# EAGLE design back (EAGLE 9.0.1)
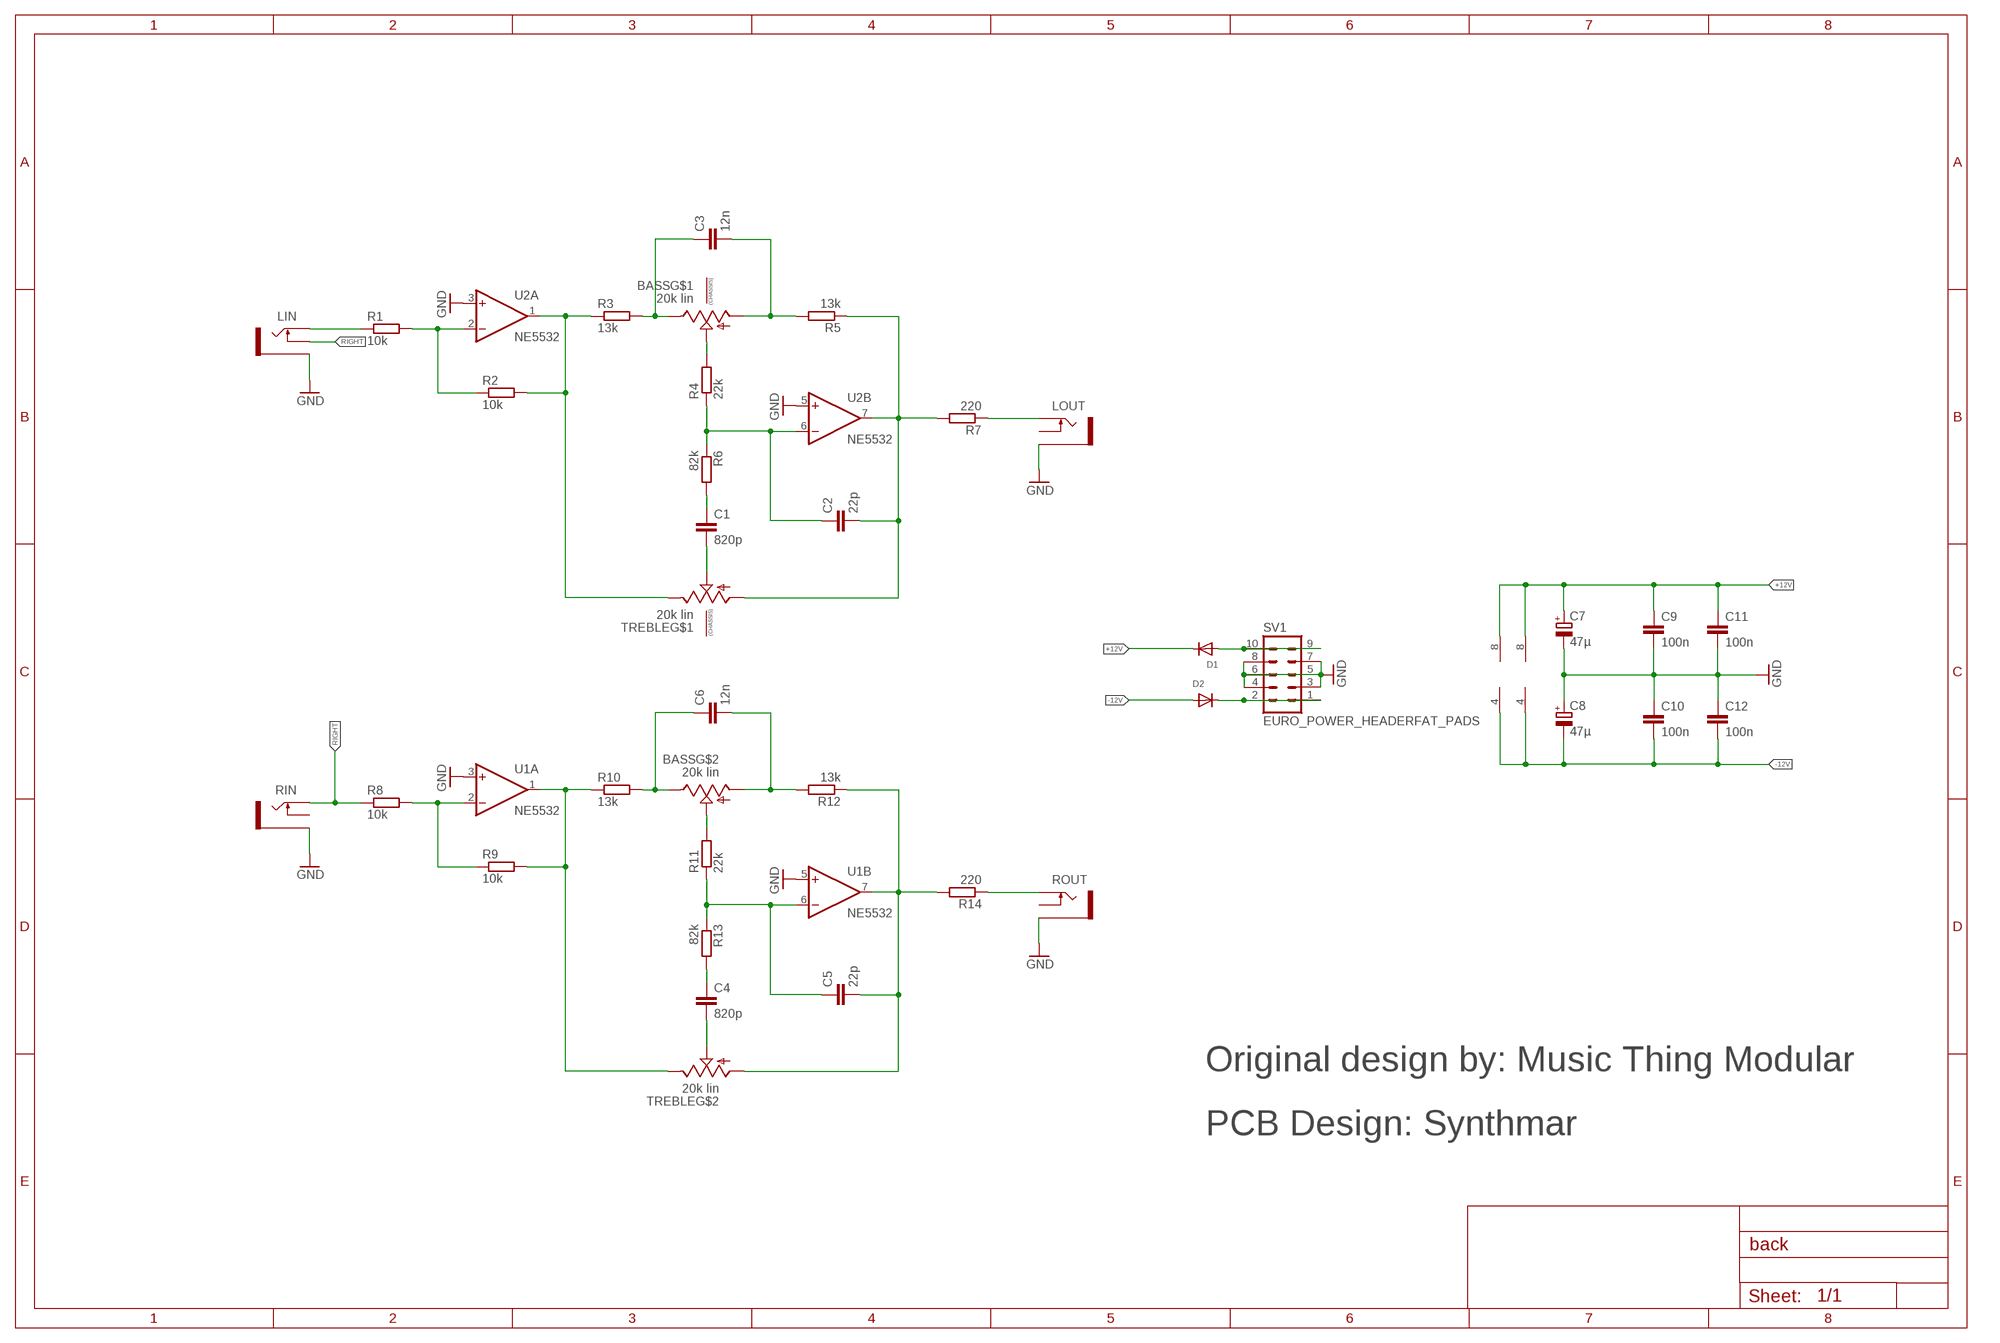
[diagram p0: schematic, sheet 1]

## Parts
BASS  20k lin  ALPHA-9MM-DUALPOT  [DUAL_9MM_SNAP-IN_POT]
C1  820p  C-EUC1206  [C1206]
C2  22p  C-EUC1206  [C1206]
C3  12n  C-EUC1206  [C1206]
C4  820p  C-EUC1206  [C1206]
C5  22p  C-EUC1206  [C1206]
C6  12n  C-EUC1206  [C1206]
C7  47µ  CPOL-EU153CLV-0505  [153CLV-0505]
C8  47µ  CPOL-EU153CLV-0505  [153CLV-0505]
C9  100n  C-EUC1206  [C1206]
C10  100n  C-EUC1206  [C1206]
C11  100n  C-EUC1206  [C1206]
C12  100n  C-EUC1206  [C1206]
D1  DIODESOD-323F  [SOD-323F]
D2  DIODESOD-323F  [SOD-323F]
LIN  THONKICONN16PJ138  [WQP-PJ301M-12_JACK]
LOUT  THONKICONN16PJ138  [WQP-PJ301M-12_JACK]
R1  10k  R-EU_M1206  [M1206]
R2  10k  R-EU_M1206  [M1206]
R3  13k  R-EU_M1206  [M1206]
R4  22k  R-EU_M1206  [M1206]
R5  13k  R-EU_M1206  [M1206]
R6  82k  R-EU_M1206  [M1206]
R7  220  R-EU_M1206  [M1206]
R8  10k  R-EU_M1206  [M1206]
R9  10k  R-EU_M1206  [M1206]
R10  13k  R-EU_M1206  [M1206]
R11  22k  R-EU_M1206  [M1206]
R12  13k  R-EU_M1206  [M1206]
R13  82k  R-EU_M1206  [M1206]
R14  220  R-EU_M1206  [M1206]
RIN  THONKICONN16PJ138  [WQP-PJ301M-12_JACK]
ROUT  THONKICONN16PJ138  [WQP-PJ301M-12_JACK]
SV1  EURO_POWER_HEADERFAT_PADS  [EURO_PWR_HEADER_FAT]
TREBLE  20k lin  ALPHA-9MM-DUALPOT  [DUAL_9MM_SNAP-IN_POT]
U1  NE5532  TL072_SMD  [SO08]
U2  NE5532  TL072_SMD  [SO08]

## Nets
+12V: C7.+ C9.1 C11.1 D1.C U1.8(P:V+) U2.8(P:V+)
-12V: C8.- C10.2 C12.2 D2.A U1.4(P:V-) U2.4(P:V-)
GND: C7.- C8.+ C9.2 C10.1 C11.2 C12.1 LIN.P$3_SLEEVE(SLEEVE) LOUT.P$3_SLEEVE(SLEEVE) RIN.P$3_SLEEVE(SLEEVE) ROUT.P$3_SLEEVE(SLEEVE) SV1.3 SV1.4 SV1.5 SV1.6 SV1.7 SV1.8 U1.3(A:+IN) U1.5(B:+IN) U2.3(A:+IN) U2.5(B:+IN)
N$1: BASS.3(E) C3.1 R3.2
N$2: R2.2 R3.1 TREBLE.3(E) U2.1(A:OUT)
N$3: R1.2 R2.1 U2.2(A:-IN)
N$4: C2.2 R5.1 R7.2 TREBLE.1(A) U2.7(B:OUT)
N$5: BASS.1(A) C3.2 R5.2
N$6: BASS.2(S) R4.2
N$7: LOUT.P$1_TIP(TIP) R7.1
N$8: C1.1 R6.2
N$9: C1.2 TREBLE.2(S)
N$10: C2.1 R4.1 R6.1 U2.6(B:-IN)
N$11: LIN.P$1_TIP(TIP) R1.1
N$12: BASS.3B(E) C6.1 R10.2
N$13: R9.2 R10.1 TREBLE.3B(E) U1.1(A:OUT)
N$14: R8.2 R9.1 U1.2(A:-IN)
N$15: C5.2 R12.1 R14.2 TREBLE.1B(A) U1.7(B:OUT)
N$16: BASS.1B(A) C6.2 R12.2
N$17: BASS.2B(S) R11.2
N$18: C4.1 R13.2
N$19: C4.2 TREBLE.2B(S)
N$20: C5.1 R11.1 R13.1 U1.6(B:-IN)
N$21: R14.1 ROUT.P$1_TIP(TIP)
N$22: D1.A SV1.9 SV1.10
N$23: D2.C SV1.1 SV1.2
RIGHT: LIN.P$2_SWITCH(SWITCH) R8.1 RIN.P$1_TIP(TIP)
Unconnected: BASS.CHASSIS1 BASS.CHASSIS2 LOUT.P$2_SWITCH(SWITCH) RIN.P$2_SWITCH(SWITCH) ROUT.P$2_SWITCH(SWITCH) TREBLE.CHASSIS1 TREBLE.CHASSIS2

## Notes on the sheet
- Original design by: Music Thing Modular
- PCB Design: Synthmar

## Library data of the parts
BASS TREBLE = MusicThingModular:ALPHA-9MM-DUALPOT: 9mm vertical snap-in pot, Alpha / Panasonic style, with a connection to the metal chassis for grounding
C1-C6 C9-C12 = resistor:C-EU: CAPACITOR, European symbol
C7 C8 = resistor:CPOL-EU: POLARIZED CAPACITOR, European symbol
D1 D2 = adafruit:DIODE: Diode SMADIODE - SMA Surface Mount Package 20V 1A Schottky Diode Digikey: 641-1014-6-ND DO-1N4148 - Through Hole Small Current Diode SOD-123 20V 1 A (.5mV Vf) Schottky Diode - Digikey: MBRX120TPMSCT-ND SOD-323 10V 570mA (.38mV Vf, 3ns) Schottky Diode - Digikey: ZLLS410CT-ND SOD-523 30V 30mA Schottky Diode (RB751S-40TE61) - Digikey: RB751S-40TE61CT-ND SOT23-R/W - SOT23 Package (R = Solder Paste/Reflow Ovens, W = Hand-Soldering) BAT54Film 40V 300mA - Digikey: 497-7162-1-ND
LIN LOUT RIN ROUT = MusicThingModular:THONKICONN: 3.5mm socket for Eurorack modular synths
R1-R14 = resistor:R-EU_: RESISTOR, European symbol
SV1 = MusicThingModular:EURO_POWER_HEADER: Power Header 10 pin power header for Eurorack Power Supplies Variants with fatter pads for easier soldering, and the LOCK variant which has 5mil offset pins to hold the component in place before soldering
U1 U2 = MusicThingModular:TL072: Generic Dual Op Amp

## Board
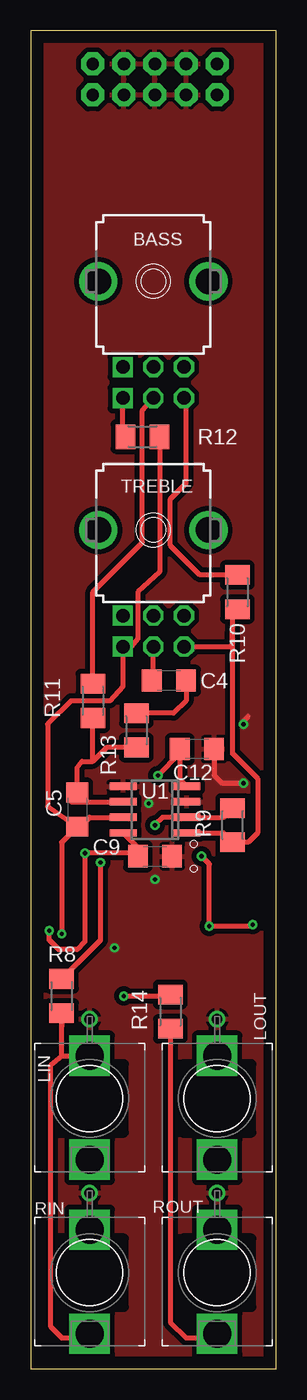
[diagram p1: board, top side]
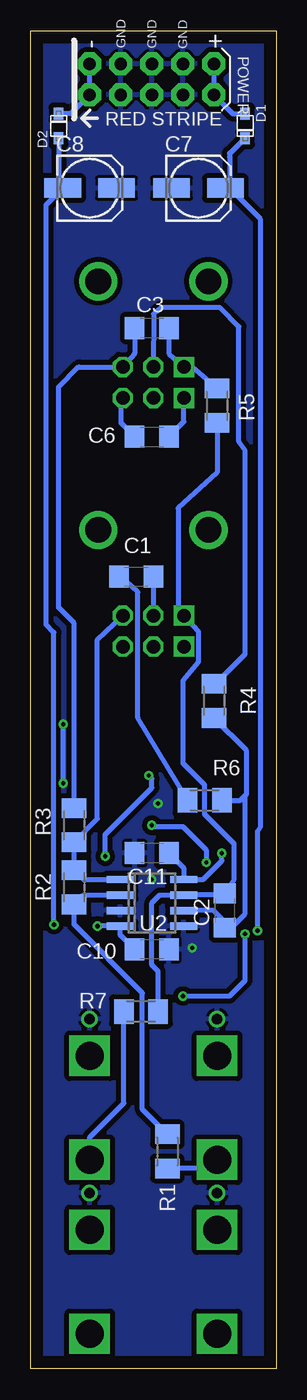
[diagram p2: board, bottom side, seen from below]

Size 20.07 x 109.4 mm. Coordinates in mm from the lower left corner, seen from the top.
Outline: 0,109.4 0,0 20.07,0 20.07,109.4 0,109.4
Copper layers (1*16): Top 0.035mm / dielectric 1.5mm / Bottom 0.035mm
Design rules "default": minimum track width 6mil, minimum drill 0.35mm, track to track 6mil, track to pad 6mil, pad to pad 6mil, via to via 6mil, smd to smd 6mil, copper to edge 40mil, drill to drill 6mil, minimum pad ring 10mil, minimum via ring 8mil, stop-mask expansion 4mil, vias tented up to drill 0mil, thermal gap 10mil

### Footprints (pad centres in the part's own frame; a part is rotated, then mirrored left to right if it is on the bottom)
DUAL_9MM_SNAP-IN_POT = drill 1.1 square: 1 -2.5,-7; 1B -2.5,-9.54 | drill 1.1 octagon: 2 0,-7; 2B 0,-9.54; 3 2.5,-7; 3B 2.5,-9.54 | drill 2.1 pad 2.184: CHASSIS1 -4.5,0; CHASSIS2 4.5,0
C1206 = smd 1.6 x 1.8: 1 -1.4,0; 2 1.4,0
153CLV-0505 = smd 3 x 1.6: + 2.2,0; - -2.2,0
SOD-323F = smd 1 x 0.8: A -1,0; C 1,0
WQP-PJ301M-12_JACK = drill 2.286 pad 2.413 square: P$1_TIP 0,5; P$2_SWITCH 0,-3.5 | drill 0.85: P$3_SLEEVE 0,-6.5
M1206 = smd 1.6 x 2: 1 -1.4,0; 2 1.4,0
EURO_PWR_HEADER_FAT = drill 1.016 pad 1.88 octagon: 1 -5.08,-1.27; 2 -5.08,1.27; 3 -2.54,-1.27; 4 -2.54,1.27; 5 0,-1.27; 6 0,1.27; 7 2.54,-1.27; 8 2.54,1.27; 9 5.08,-1.27; 10 5.08,1.27
SO08 = smd 0.6 x 2.2: 1 -1.905,-2.6; 2 -0.635,-2.6; 3 0.635,-2.6; 4 1.905,-2.6; 5 1.905,2.6; 6 0.635,2.6; 7 -0.635,2.6; 8 -1.905,2.6

### Placement (x,y rotation side)
BASS  10.03,88.9 0 top
C1  11.43,64.77 0 bottom
C2  4.19,37.47 90 bottom
C3  10.16,85.09 0 bottom
C4  11.3,56.26 180 top
C5  3.81,45.72 270 top
C6  10.16,76.2 0 bottom
C7  6.35,96.52 0 bottom
C8  15.24,96.52 0 bottom
C9  10.16,41.91 0 top
C10  10.16,34.29 180 bottom
C11  10.16,42.16 180 bottom
C12  13.59,50.67 180 top
D1  2.54,101.6 270 bottom
D2  17.78,101.6 90 bottom
LIN  4.83,22.1 180 top
LOUT  15.24,22.1 180 top
R1  8.89,17.78 90 bottom
R2  16.51,39.37 90 bottom
R3  16.51,44.45 90 bottom
R4  5.08,54.61 90 bottom
R5  4.83,78.74 90 bottom
R6  5.84,46.48 180 bottom
R7  11.05,29.21 0 bottom
R8  2.54,30.48 90 top
R9  16.51,44.45 270 top
R10  16.89,63.5 90 top
R11  5.08,54.61 90 top
R12  9.14,76.2 180 top
R13  8.64,52.2 90 top
R14  11.43,29.21 90 top
RIN  4.83,7.87 180 top
ROUT  15.24,7.87 180 top
SV1  10.16,105.41 0 bottom
TREBLE  10.03,68.58 0 top
U1  10.16,45.72 90 top
U2  10.16,38.1 270 bottom

### Tracks (layer width: path | path; a pad name or v marks a point on that pad's centre or on a via)
+12V  (via drill 0.35)
  Top 0.406: U1.8 8.76,42.62 C9.1 8.51,42.16 v4.45,42.16 4.45,34.92 3.81,34.29 2.29,34.29 1.52,35.05 v1.52,35.81
  Bottom 0.406: C11.1 7.56,40.96 U2.8 5.97,40.01 4.45,41.53 v4.45,42.16 | C7.+ 3.98,96.69 3.81,96.52 | v1.52,35.81 1.52,43.94 1.27,44.32 1.27,93.98 3.81,96.52 | 3.81,99.42 3.81,99.33 | 3.81,96.52 3.81,99.06 3.81,99.33 | D1.C 3.81,99.33
-12V  (via drill 0.35)
  Top 0.406: v18.16,36.32 18.03,36.2 v14.61,36.2 14.61,41.27 v13.97,41.91 | U1.4 12.19,48.2 C12.2 12.19,50.29 v10.41,48.51
  Bottom 0.406: C10.2 12.76,35.49 U2.4 v14.61,36.2 14.73,36.2 | v18.16,36.32 18.16,60.2 18.8,60.83 18.8,95.16 17.61,96.35 | 17.61,96.35 C8.- | v13.97,41.91 13.97,43.69 10.16,47.5 10.16,48.26 v10.41,48.51 | 18.03,96.77 17.78,96.52 | D2.A 17.78,96.52 | 17.78,96.52 17.61,96.35
GND  (via drill 0.35)
  Top 0.406: C12.1 14.99,48.51 15.62,47.88 v17.4,47.88 | v17.4,52.7 17.4,52.96 17.78,53.34
  Bottom 0.406: v17.4,47.88 v17.4,52.7
  other vias: 9.65,46.23 10.16,40.01 6.86,34.42
  pour Bottom (isolate 0.406): -2.54,111.76 22.86,111.76 22.86,0 -2.54,0
  pour Bottom (isolate 0.406): -2.54,111.76 22.86,111.76 22.86,0 -2.54,0
  pour Top (isolate 0.406): 22.86,111.76 -2.54,111.76 -2.54,0 22.86,0
N$1
  Bottom 0.406: C3.1 11.56,83 BASS.3 16.11,81.9 16.13,81.92 17.78,80.26 17.78,62.23 16.51,60.96 R3.2
N$2
  Bottom 0.406: U2.1 15.74,40.01 R2.2 R3.1 14.61,44.95 14.61,59.63 TREBLE.3
N$3
  Bottom 0.406: U2.2 15.74,38.73 R2.1 16.51,36.32 10.92,30.73 10.92,21.21 R1.2
N$4
  Bottom 0.406: R5.1 4.83,73.28 8,70.36 8,61.92 TREBLE.1 6.35,60.27 6.35,57.78 7.62,56.26 7.62,49.53 5.84,47.75 5.84,45.34 3.43,42.93 3.43,40.01 C2.2 4.58,38.73 U2.7 9.53,38.73 10.16,38.1 10.16,33.02 9.65,32.51 R7.2
N$5
  Bottom 0.406: C3.2 8.76,83 BASS.1 6.84,81.9 R5.2
N$6
  Bottom 0.406: R4.2 4.95,56.01 2.54,58.42 2.54,75.06 3.05,75.82 3.05,85.22 4.57,86.74 9.4,86.74 10.02,86.23 BASS.2
N$7
  Bottom 0.406: LOUT.P$1_TIP 15.24,18.92 12.45,21.71 R7.1
N$8
  Bottom 0.406: R6.2 11.3,53.21 11.3,63.5 12.7,64.77 C1.1
N$9
  Bottom 0.406: C1.2 10.03,61.71 TREBLE.2
N$10
  Bottom 0.406: U2.6 5.08,37.47 3.69,36.07 3.69,36.06 | R4.1 2.41,50.54 2.41,46.99 2.54,46.86 | R6.1 2.92,46.48 2.54,46.86 | 3.69,36.06 C2.1 | 3.69,36.06 2.54,37.21 2.54,46.86
N$11
  Bottom 0.406: LIN.P$1_TIP 5.29,16.38 R1.1
N$12
  Top 0.406: R10.2 13.84,64.9 11.43,67.31 11.43,71.12 12.7,72.39 12.7,79.19 BASS.3B 12.7,79.32
  Bottom 0.406: C6.1 12.66,77.3 12.66,79.23 BASS.3B
N$13
  Top 0.406: 16.51,61.59 16.51,50.29 18.54,48.26 18.54,43.81 17.78,43.05 R9.2 15.74,43.81 U1.1 | 16.51,61.59 R10.1 | 16.51,61.59 16.5,59.04 TREBLE.3B
N$14  (via drill 0.35)
  Top 0.406: R9.1 15.74,45.09 U1.2 10.79,45.09 v10.16,44.45 | R8.2 5.71,35.05 v5.71,41.4
  Bottom 0.406: v10.16,44.45 10.03,44.32 7.62,44.32 5.71,42.42 v5.71,41.4
N$15  (via drill 0.35)
  Top 0.406: R12.1 10.54,65.15 8.76,63.5 8.76,59.69 8.24,59.04 TREBLE.1B 7.53,55.79 6.48,54.61 3.3,54.61 1.4,52.7 1.4,45.97 C5.2 | C5.2 4.06,44.32 4.83,45.09 U1.7 | C5.2 2.54,43.05 v2.54,35.56 | v7.62,30.48 11.3,30.48 R14.2
  Bottom 0.406: v7.62,30.48 3.81,30.48 2.54,31.75 v2.54,35.56
N$16
  Top 0.406: R12.2 7.53,76.79 BASS.1B
  Bottom 0.406: C6.2 7.53,77.43 BASS.1B
N$17
  Top 0.406: R11.2 5.08,63.5 9.14,67.56 9.14,78.34 BASS.2B
N$18
  Top 0.406: C4.1 12.7,54.61 11.69,53.6 R13.2
N$19
  Top 0.406: C4.2 10.03,56.01 TREBLE.2B
N$20
  Top 0.406: U1.6 3.31,46.35 C5.1 3.81,49.15 4.19,49.66 5.08,49.66 | 5.08,49.66 R11.1 | R13.1 6.22,50.8 5.08,49.66
N$21
  Top 0.406: R14.1 11.43,3.81 12.7,2.54 15.24,2.54 ROUT.P$1_TIP
N$22
  Bottom 0.406: SV1.10 SV1.9 | SV1.9 4.98,104.04 | SV1.9 3.54,102.6 D1.A
N$23
  Bottom 0.406: SV1.2 SV1.1 16.78,102.6 D2.C
RIGHT
  Top 0.406: RIN.P$1_TIP 5.08,2.54 2.54,2.54 1.65,3.43 1.65,24.84 2.54,25.6 | 2.54,25.6 LIN.P$2_SWITCH | 2.54,27.94 R8.1 2.54,25.6